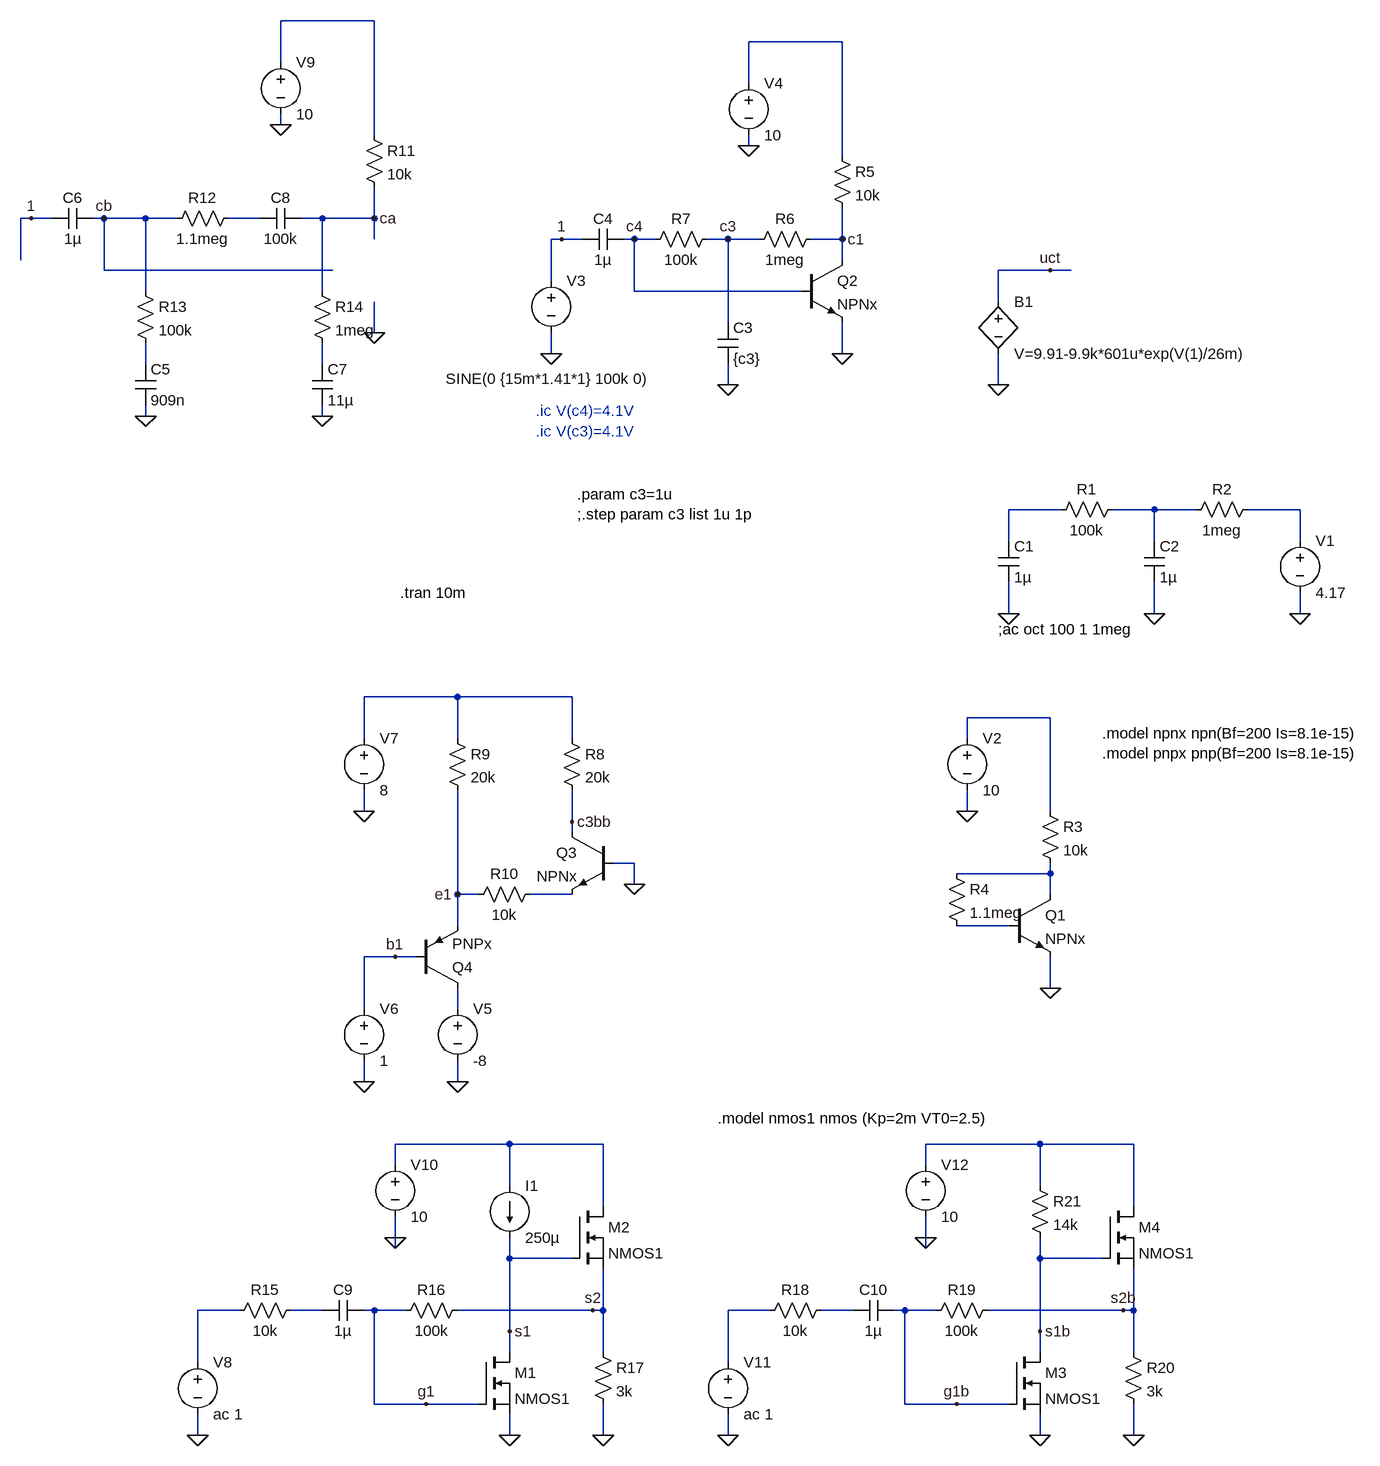
[diagram p0: schematic ss2011_klirr.asc]
ss2011_klirr.asc, the LTspice schematic file:
Version 4
SHEET 1 880 1540
WIRE -912 -656 -1056 -656
WIRE -192 -624 -336 -624
WIRE -1056 -592 -1056 -656
WIRE -336 -560 -336 -624
WIRE -1056 -496 -1056 -512
WIRE -912 -480 -912 -656
WIRE -336 -464 -336 -480
WIRE -192 -448 -192 -624
WIRE -1440 -352 -1456 -352
WIRE -1408 -352 -1440 -352
WIRE -1328 -352 -1344 -352
WIRE -1264 -352 -1328 -352
WIRE -1216 -352 -1264 -352
WIRE -1088 -352 -1136 -352
WIRE -992 -352 -1024 -352
WIRE -912 -352 -912 -400
WIRE -912 -352 -992 -352
WIRE -912 -320 -912 -352
WIRE -624 -320 -640 -320
WIRE -592 -320 -624 -320
WIRE -512 -320 -528 -320
WIRE -480 -320 -512 -320
WIRE -368 -320 -400 -320
WIRE -320 -320 -368 -320
WIRE -192 -320 -192 -368
WIRE -192 -320 -240 -320
WIRE -1456 -288 -1456 -352
WIRE -192 -288 -192 -320
WIRE -1328 -272 -1328 -352
WIRE -976 -272 -1328 -272
WIRE 128 -272 48 -272
WIRE 160 -272 128 -272
WIRE -640 -256 -640 -320
WIRE -1264 -240 -1264 -352
WIRE -992 -240 -992 -352
WIRE -512 -240 -512 -320
WIRE -256 -240 -512 -240
WIRE 48 -224 48 -272
WIRE -368 -192 -368 -320
WIRE -912 -176 -912 -224
WIRE -640 -144 -640 -176
WIRE -192 -144 -192 -192
WIRE -1264 -128 -1264 -160
WIRE -992 -128 -992 -160
WIRE -368 -96 -368 -128
WIRE 48 -96 48 -144
WIRE -1264 -48 -1264 -64
WIRE -992 -48 -992 -64
WIRE 144 96 64 96
WIRE 288 96 224 96
WIRE 352 96 288 96
WIRE 512 96 432 96
WIRE 64 144 64 96
WIRE 288 144 288 96
WIRE 512 144 512 96
WIRE 64 256 64 208
WIRE 288 256 288 208
WIRE 512 256 512 224
WIRE -784 384 -928 384
WIRE -608 384 -784 384
WIRE 128 416 0 416
WIRE -928 448 -928 384
WIRE -784 448 -784 384
WIRE -608 448 -608 384
WIRE 0 448 0 416
WIRE -928 560 -928 528
WIRE 0 560 0 528
WIRE 128 560 128 416
WIRE -608 576 -608 528
WIRE -608 592 -608 576
WIRE -512 640 -544 640
WIRE 128 656 128 640
WIRE 128 656 -16 656
WIRE -512 672 -512 640
WIRE -784 688 -784 528
WIRE -752 688 -784 688
WIRE -608 688 -672 688
WIRE 128 688 128 656
WIRE -784 736 -784 688
WIRE 64 736 -16 736
WIRE -880 784 -928 784
WIRE -848 784 -880 784
WIRE 128 832 128 784
WIRE -928 864 -928 784
WIRE -784 864 -784 832
WIRE -928 976 -928 944
WIRE -784 976 -784 944
WIRE -704 1072 -880 1072
WIRE -560 1072 -704 1072
WIRE 112 1072 -64 1072
WIRE 256 1072 112 1072
WIRE -880 1104 -880 1072
WIRE -64 1104 -64 1072
WIRE -704 1136 -704 1072
WIRE 112 1136 112 1072
WIRE -560 1168 -560 1072
WIRE 256 1168 256 1072
WIRE -880 1216 -880 1184
WIRE -64 1216 -64 1184
WIRE -880 1232 -880 1216
WIRE -64 1232 -64 1216
WIRE -704 1248 -704 1216
WIRE -608 1248 -704 1248
WIRE 112 1248 112 1216
WIRE 208 1248 112 1248
WIRE -1120 1328 -1184 1328
WIRE -992 1328 -1040 1328
WIRE -912 1328 -928 1328
WIRE -864 1328 -912 1328
WIRE -576 1328 -784 1328
WIRE -560 1328 -560 1264
WIRE -560 1328 -576 1328
WIRE -304 1328 -368 1328
WIRE -176 1328 -224 1328
WIRE -96 1328 -112 1328
WIRE -48 1328 -96 1328
WIRE 240 1328 32 1328
WIRE 256 1328 256 1264
WIRE 256 1328 240 1328
WIRE -704 1360 -704 1248
WIRE 112 1360 112 1248
WIRE -704 1392 -704 1360
WIRE -560 1392 -560 1328
WIRE 112 1392 112 1360
WIRE 256 1392 256 1328
WIRE -1184 1408 -1184 1328
WIRE -368 1408 -368 1328
WIRE -912 1472 -912 1328
WIRE -832 1472 -912 1472
WIRE -752 1472 -832 1472
WIRE -96 1472 -96 1328
WIRE -16 1472 -96 1472
WIRE 64 1472 -16 1472
WIRE -1184 1520 -1184 1488
WIRE -704 1520 -704 1488
WIRE -560 1520 -560 1472
WIRE -368 1520 -368 1488
WIRE 112 1520 112 1488
WIRE 256 1520 256 1472
FLAG 512 256 0
FLAG 288 256 0
FLAG 64 256 0
FLAG 128 832 0
FLAG 0 560 0
FLAG -336 -464 0
FLAG -192 -144 0
FLAG -368 -96 0
FLAG -640 -144 0
FLAG -368 -320 c3
FLAG -512 -320 c4
FLAG -192 -320 c1
FLAG -624 -320 1
FLAG -928 560 0
FLAG -928 976 0
FLAG -784 976 0
FLAG -512 672 0
FLAG -880 784 b1
FLAG -608 576 c3bb
FLAG -784 688 e1
FLAG 48 -96 0
FLAG 128 -272 uct
FLAG -1056 -496 0
FLAG -912 -176 0
FLAG -1328 -352 cb
FLAG -912 -352 ca
FLAG -1440 -352 1
FLAG -992 -48 0
FLAG -1264 -48 0
FLAG -1184 1520 0
FLAG -704 1520 0
FLAG -560 1520 0
FLAG -880 1216 0
FLAG -576 1328 s2
FLAG -704 1360 s1
FLAG -832 1472 g1
FLAG -368 1520 0
FLAG 112 1520 0
FLAG 256 1520 0
FLAG -64 1216 0
FLAG 240 1328 s2b
FLAG 112 1360 s1b
FLAG -16 1472 g1b
SYMBOL cap 48 144 R0
SYMATTR InstName C1
SYMATTR Value 1µ
SYMBOL cap 272 144 R0
SYMATTR InstName C2
SYMATTR Value 1µ
SYMBOL res 240 80 R90
WINDOW 0 0 56 VBottom 2
WINDOW 3 32 56 VTop 2
SYMATTR InstName R1
SYMATTR Value 100k
SYMBOL res 448 80 R90
WINDOW 0 0 56 VBottom 2
WINDOW 3 32 56 VTop 2
SYMATTR InstName R2
SYMATTR Value 1meg
SYMBOL voltage 512 128 R0
WINDOW 123 0 0 Left 2
WINDOW 39 0 0 Left 2
SYMATTR InstName V1
SYMATTR Value 4.17
SYMBOL npn 64 688 R0
SYMATTR InstName Q1
SYMATTR Value NPNx
SYMBOL res 112 544 R0
SYMATTR InstName R3
SYMATTR Value 10k
SYMBOL res -32 640 R0
SYMATTR InstName R4
SYMATTR Value 1.1meg
SYMBOL voltage 0 432 R0
WINDOW 123 0 0 Left 2
WINDOW 39 0 0 Left 2
SYMATTR InstName V2
SYMATTR Value 10
SYMBOL npn -256 -288 R0
SYMATTR InstName Q2
SYMATTR Value NPNx
SYMBOL res -208 -464 R0
SYMATTR InstName R5
SYMATTR Value 10k
SYMBOL res -336 -304 R270
WINDOW 0 32 56 VTop 2
WINDOW 3 0 56 VBottom 2
SYMATTR InstName R6
SYMATTR Value 1meg
SYMBOL res -496 -304 R270
WINDOW 0 32 56 VTop 2
WINDOW 3 0 56 VBottom 2
SYMATTR InstName R7
SYMATTR Value 100k
SYMBOL cap -384 -192 R0
SYMATTR InstName C3
SYMATTR Value {c3}
SYMBOL cap -528 -336 R90
WINDOW 0 0 32 VBottom 2
WINDOW 3 32 32 VTop 2
SYMATTR InstName C4
SYMATTR Value 1µ
SYMBOL voltage -640 -272 R0
WINDOW 3 -162 167 Left 2
WINDOW 123 -162 195 Left 2
WINDOW 39 0 0 Left 2
SYMATTR Value SINE(0 {15m*1.41*1} 100k 0)
SYMATTR InstName V3
SYMBOL voltage -336 -576 R0
SYMATTR InstName V4
SYMATTR Value 10
SYMBOL npn -544 592 M0
SYMATTR InstName Q3
SYMATTR Value NPNx
SYMBOL res -624 432 R0
SYMATTR InstName R8
SYMATTR Value 20k
SYMBOL res -800 432 R0
SYMATTR InstName R9
SYMATTR Value 20k
SYMBOL res -656 672 R90
WINDOW 0 0 56 VBottom 2
WINDOW 3 32 56 VTop 2
SYMATTR InstName R10
SYMATTR Value 10k
SYMBOL pnp -848 832 M180
SYMATTR InstName Q4
SYMATTR Value PNPx
SYMBOL voltage -784 848 R0
SYMATTR InstName V5
SYMATTR Value -8
SYMBOL voltage -928 848 R0
WINDOW 123 0 0 Left 2
WINDOW 39 0 0 Left 2
SYMATTR InstName V6
SYMATTR Value 1
SYMBOL voltage -928 432 R0
SYMATTR InstName V7
SYMATTR Value 8
SYMBOL bv 48 -240 R0
SYMATTR InstName B1
SYMATTR Value V=9.91-9.9k*601u*exp(V(1)/26m)
SYMBOL res -928 -496 R0
SYMATTR InstName R11
SYMATTR Value 10k
SYMBOL res -1232 -336 R270
WINDOW 0 32 56 VTop 2
WINDOW 3 0 56 VBottom 2
SYMATTR InstName R12
SYMATTR Value 1.1meg
SYMBOL cap -1344 -368 R90
WINDOW 0 0 32 VBottom 2
WINDOW 3 32 32 VTop 2
SYMATTR InstName C6
SYMATTR Value 1µ
SYMBOL voltage -1056 -608 R0
SYMATTR InstName V9
SYMATTR Value 10
SYMBOL res -1280 -256 R0
SYMATTR InstName R13
SYMATTR Value 100k
SYMBOL cap -1280 -128 R0
SYMATTR InstName C5
SYMATTR Value 909n
SYMBOL cap -1008 -128 R0
SYMATTR InstName C7
SYMATTR Value 11µ
SYMBOL res -1008 -256 R0
SYMATTR InstName R14
SYMATTR Value 1meg
SYMBOL cap -1024 -368 R90
WINDOW 0 0 32 VBottom 2
WINDOW 3 32 32 VTop 2
SYMATTR InstName C8
SYMATTR Value 100k
SYMBOL voltage -1184 1392 R0
WINDOW 123 0 0 Left 2
WINDOW 39 0 0 Left 2
SYMATTR InstName V8
SYMATTR Value ac 1
SYMBOL res -1024 1312 R90
WINDOW 0 0 56 VBottom 2
WINDOW 3 32 56 VTop 2
SYMATTR InstName R15
SYMATTR Value 10k
SYMBOL cap -928 1312 R90
WINDOW 0 0 32 VBottom 2
WINDOW 3 32 32 VTop 2
SYMATTR InstName C9
SYMATTR Value 1µ
SYMBOL res -768 1312 R90
WINDOW 0 0 56 VBottom 2
WINDOW 3 32 56 VTop 2
SYMATTR InstName R16
SYMATTR Value 100k
SYMBOL nmos -752 1392 R0
SYMATTR InstName M1
SYMATTR Value NMOS1
SYMBOL nmos -608 1168 R0
SYMATTR InstName M2
SYMATTR Value NMOS1
SYMBOL res -576 1376 R0
SYMATTR InstName R17
SYMATTR Value 3k
SYMBOL current -704 1136 R0
WINDOW 123 0 0 Left 2
WINDOW 39 0 0 Left 2
SYMATTR InstName I1
SYMATTR Value 250µ
SYMBOL voltage -880 1088 R0
WINDOW 123 0 0 Left 2
WINDOW 39 0 0 Left 2
SYMATTR InstName V10
SYMATTR Value 10
SYMBOL voltage -368 1392 R0
WINDOW 123 0 0 Left 2
WINDOW 39 0 0 Left 2
SYMATTR InstName V11
SYMATTR Value ac 1
SYMBOL res -208 1312 R90
WINDOW 0 0 56 VBottom 2
WINDOW 3 32 56 VTop 2
SYMATTR InstName R18
SYMATTR Value 10k
SYMBOL cap -112 1312 R90
WINDOW 0 0 32 VBottom 2
WINDOW 3 32 32 VTop 2
SYMATTR InstName C10
SYMATTR Value 1µ
SYMBOL res 48 1312 R90
WINDOW 0 0 56 VBottom 2
WINDOW 3 32 56 VTop 2
SYMATTR InstName R19
SYMATTR Value 100k
SYMBOL nmos 64 1392 R0
SYMATTR InstName M3
SYMATTR Value NMOS1
SYMBOL nmos 208 1168 R0
SYMATTR InstName M4
SYMATTR Value NMOS1
SYMBOL res 240 1376 R0
SYMATTR InstName R20
SYMATTR Value 3k
SYMBOL voltage -64 1088 R0
WINDOW 123 0 0 Left 2
WINDOW 39 0 0 Left 2
SYMATTR InstName V12
SYMATTR Value 10
SYMBOL res 96 1120 R0
SYMATTR InstName R21
SYMATTR Value 14k
TEXT 48 280 Left 2 !;ac oct 100 1 1meg
TEXT 208 440 Left 2 !.model npnx npn(Bf=200 Is=8.1e-15)\n.model pnpx pnp(Bf=200 Is=8.1e-15)
TEXT -664 -56 Left 2 ;.ic V(c4)=4.1V\n.ic V(c3)=4.1V
TEXT -600 72 Left 2 !.param c3=1u\n;.step param c3 list 1u 1p
TEXT -384 1032 Left 2 !.model nmos1 nmos (Kp=2m VT0=2.5)
TEXT -872 224 Left 2 !.tran 10m

The netlist it stands for:
* ss2011_klirr.asc
C1 N006 0 1µ
C2 N007 0 1µ
R1 N007 N006 100k
R2 N008 N007 1meg
V1 N008 0 4.17
Q1 N011 N013 0 0 NPNx
R3 N010 N011 10k
R4 N011 N013 1.1meg
V2 N010 0 10
Q2 c1 c4 0 0 NPNx
R5 N002 c1 10k
R6 c3 c1 1meg
R7 c4 c3 100k
C3 c3 0 {c3}
C4 c4 1 1µ
V3 1 0 SINE(0 {15m*1.41*1} 100k 0)
V4 N002 0 10
Q3 c3bb 0 N012 0 NPNx
R8 N009 c3bb 20k
R9 N009 e1 20k
R10 N012 e1 10k
Q4 N014 b1 e1 0 PNPx
V5 N014 0 -8
V6 b1 0 1
V7 N009 0 8
B1 uct 0 V=9.91-9.9k*601u*exp(V(1)/26m)
R11 N001 ca 10k
R12 cb N003 1.1meg
C6 cb 1 1µ
V9 N001 0 10
R13 cb N004 100k
C5 N004 0 909n
C7 N005 0 11µ
R14 ca N005 1meg
C8 ca N003 100k
V8 N017 0 ac 1
R15 N018 N017 10k
C9 g1 N018 1µ
R16 s2 g1 100k
M1 s1 g1 0 0 NMOS1
M2 N015 s1 s2 s2 NMOS1
R17 s2 0 3k
I1 N015 s1 250µ
V10 N015 0 10
V11 N019 0 ac 1
R18 N020 N019 10k
C10 g1b N020 1µ
R19 s2b g1b 100k
M3 s1b g1b 0 0 NMOS1
M4 N016 s1b s2b s2b NMOS1
R20 s2b 0 3k
V12 N016 0 10
R21 N016 s1b 14k
.model NPN NPN
.model PNP PNP
.lib standard.bjt
.model NMOS NMOS
.model PMOS PMOS
.lib standard.mos
;ac oct 100 1 1meg
.model npnx npn(Bf=200 Is=8.1e-15)
.model pnpx pnp(Bf=200 Is=8.1e-15)
* .ic V(c4)=4.1V
* .ic V(c3)=4.1V
.param c3=1u
;.step param c3 list 1u 1p
.model nmos1 nmos (Kp=2m VT0=2.5)
.tran 10m
.backanno
.end